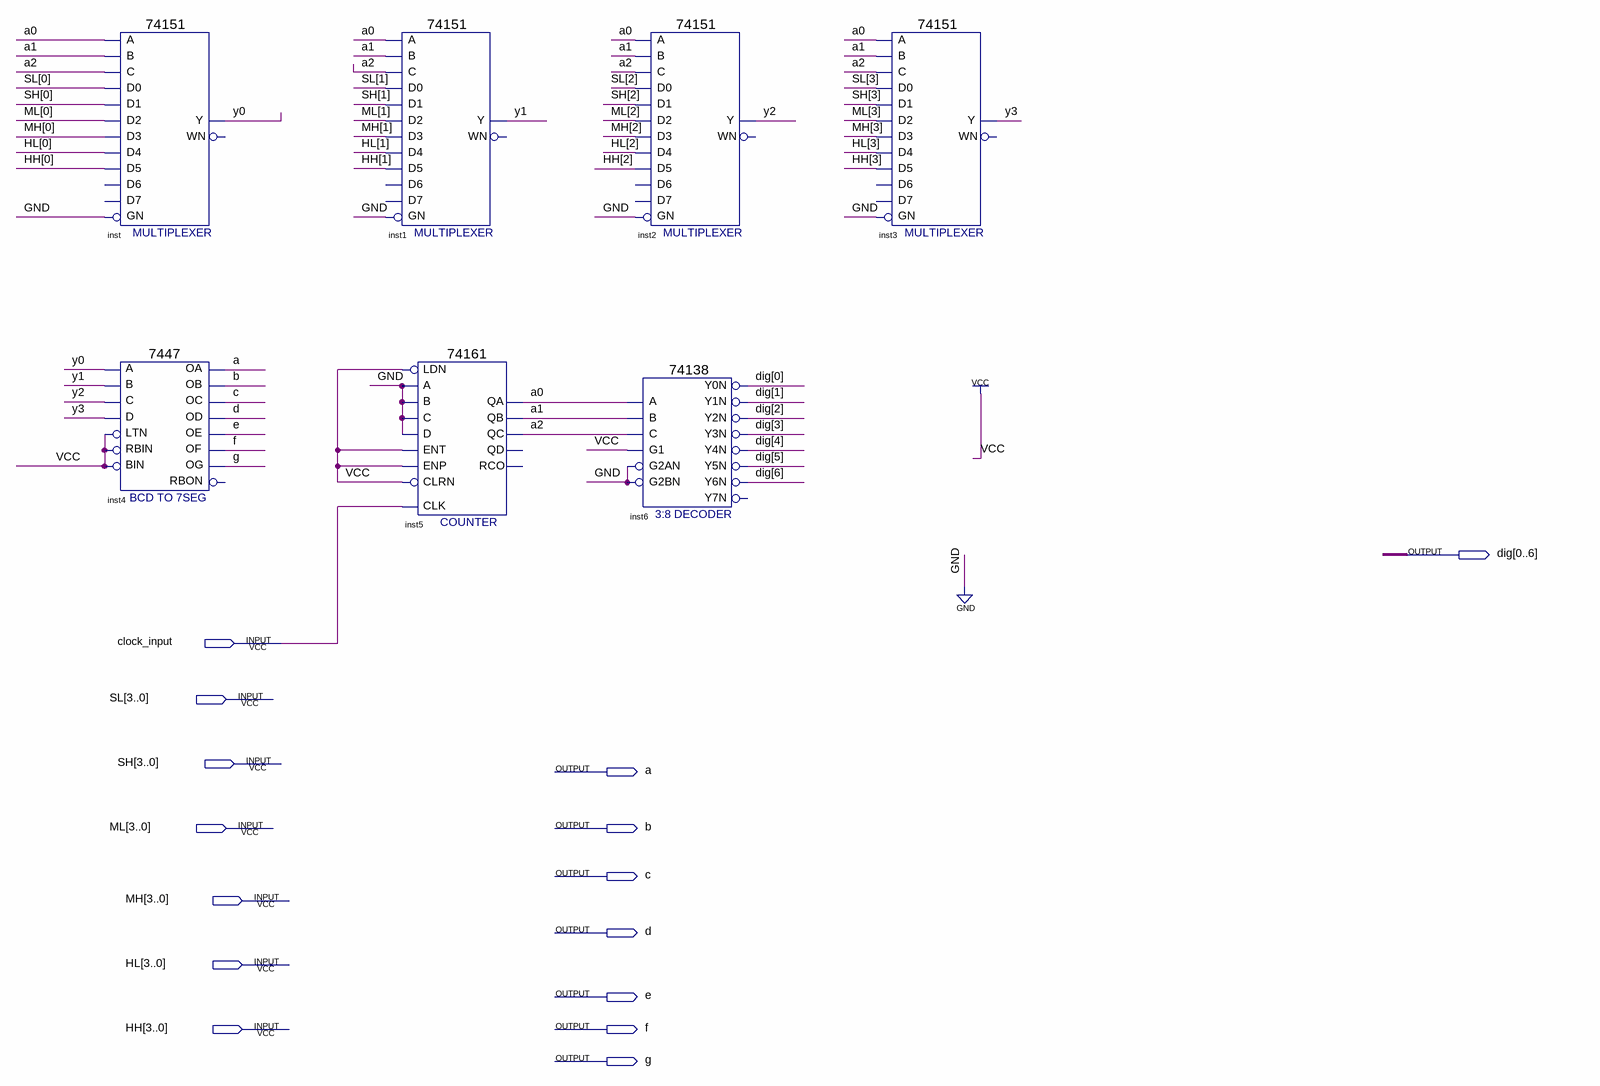
[diagram p0: schematic sheet]
// Quartus schematic dynamic.bdf as structural Verilog: 7 symbols, 15 pins
module dynamic (
  input  clock_input,
  input  [3:0] SL,
  input  [3:0] SH,
  input  [3:0] ML,
  input  [3:0] MH,
  input  [3:0] HL,
  input  [3:0] HH,
  output [0:6] dig,
  output a,
  output b,
  output c,
  output d,
  output e,
  output f,
  output g
);

  wire a0, a1, a2, y0, y1, y2, y3;

  \74151  inst (
    .GN(1'b0), .C(a2), .B(a1), .A(a0), .D5(HH[0]), .D0(SL[0]), .D1(SH[0]), .D4(HL[0]), .D3(MH[0]),
    .D2(ML[0]), .Y(y0));  // open: D6, D7, WN
  \7447  inst4 (
    .LTN(1'b1), .B(y1), .C(y2), .D(y3), .RBIN(1'b1), .BIN(1'b1), .A(y0), .OB(b), .OC(c), .OE(e), .OD(d),
    .OF(f), .OG(g), .OA(a));  // open: RBON
  \74151  inst1 (
    .GN(1'b0), .C(a2), .B(a1), .A(a0), .D5(HH[1]), .D0(SL[1]), .D1(SH[1]), .D4(HL[1]), .D3(MH[1]),
    .D2(ML[1]), .Y(y1));  // open: D6, D7, WN
  \74161  inst5 (
    .CLRN(1'b1), .CLK(clock_input), .ENP(1'b1), .LDN(1'b1), .A(1'b0), .D(1'b0), .ENT(1'b1), .B(1'b0),
    .C(1'b0), .QC(a2), .QB(a1), .QA(a0));  // open: QD, RCO
  \74151  inst2 (
    .GN(1'b0), .C(a2), .B(a1), .A(a0), .D5(HH[2]), .D0(SL[2]), .D1(SH[2]), .D4(HL[2]), .D3(MH[2]),
    .D2(ML[2]), .Y(y2));  // open: D6, D7, WN
  \74138  inst6 (
    .A(a0), .B(a1), .G1(1'b1), .C(a2), .G2AN(1'b0), .G2BN(1'b0), .Y0N(dig[0]), .Y1N(dig[1]), .Y2N(dig[2]),
    .Y3N(dig[3]), .Y4N(dig[4]), .Y5N(dig[5]), .Y6N(dig[6]));  // open: Y7N
  \74151  inst3 (
    .GN(1'b0), .C(a2), .B(a1), .A(a0), .D5(HH[3]), .D0(SL[3]), .D1(SH[3]), .D4(HL[3]), .D3(MH[3]),
    .D2(ML[3]), .Y(y3));  // open: D6, D7, WN
endmodule
